# Altium schematic sheet -LTC3417.SchDoc
size A4
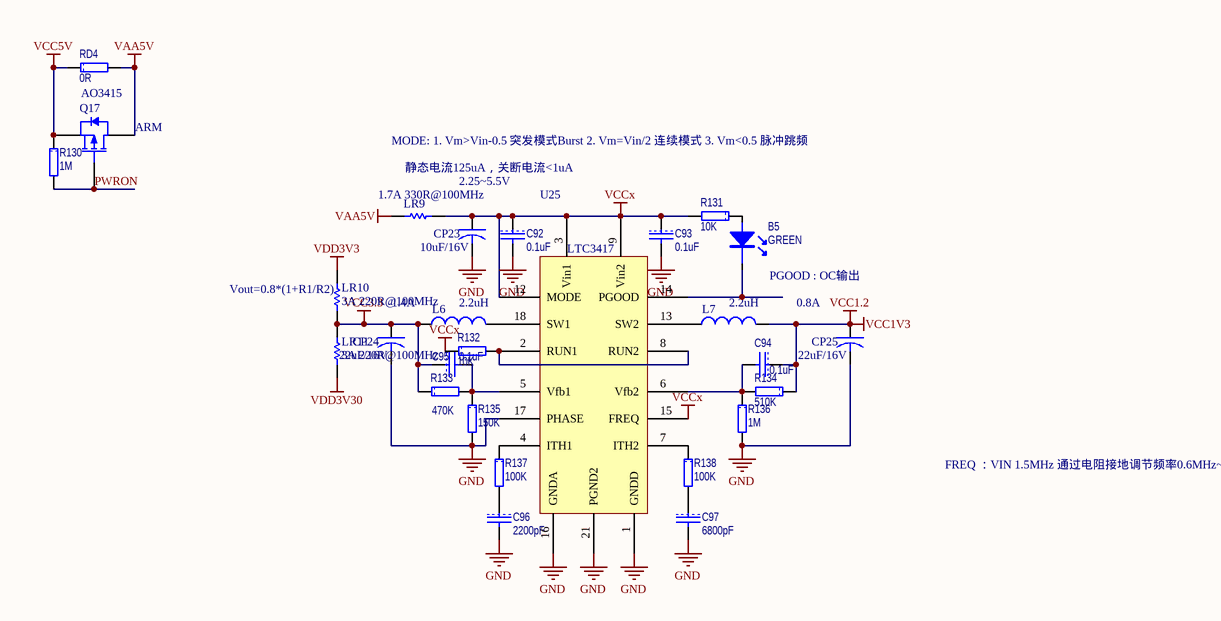
[diagram p0: -LTC3417.SchDoc]

## Parts
B5  GREEN  [LED0805]
C92  0.1uF  [1608[0603]]
C93  0.1uF  [1608[0603]]
C94  0.1uF  [1608[0603]]
C95  0.1uF  [1608[0603]]
C96  2200pF  [1608[0603]]
C97  6800pF  [1608[0603]]
CP23  10uF/16V  [3216[1206]]
CP24  22uF/16V  [3216[1206]]
CP25  22uF/16V  [3216[1206]]
L6  value 2.2uH  [INDP5050X28N - duplicate]  (hidden comment: CDRH4D22/HP 1R5)
L7  value 2.2uH  [INDP3232]  (hidden comment: CDRH2D18/HP 2R2)
LR9  value 1.7A 330R@100MHz  [0603RV]  (hidden comment: MPZ1608S331A)
LR10  value 3A 220R@100MHz  [2012[0805]]  (hidden comment: MPZ2012S221A)
LR11  value 3A 220R@100MHz  [2012[0805]]  (hidden comment: MPZ2012S221A)
Q17  AO3415  [SOT23_N]
R130  1M  [0603R]
R131  10K  [0603R]
R132  10K  [0603R]
R133  470K  [0603R]
R134  510K  [0603R]
R135  150K  [0603R]
R136  1M  [0603R]
R137  100K  [0603R]
R138  100K  [0603R]
RD4  0R  [0603RN]
U25  LTC3417  [TSSOP20-FE/CA]

## Nets
GND: C92.2 C93.2 C96.2 C97.2 CP23.2 CP24.2 CP25.2 R135.2 R136.2 U25.1(GNDD) U25.16(GNDA) U25.17(PHASE) U25.21(PGND2)
VAA5V: LR9.1 Q17.3(D) RD4.2
VCC1.2: C94.1 CP25.1 L7.2 R134.1  [also labelled VCC1V3]
VCC3.3: C95.1 CP24.1 L6.1 LR10.1 LR11.2 R133.1
VCC5V: Q17.2(S) R130.1 RD4.1
VCCx: C92.1 C93.1 CP23.1 LR9.2 R131.2 R132.1 U25.3(Vin1) U25.9(Vin2) U25.12(MODE) U25.15(FREQ)
VDD3V3: LR10.2
VDD3V30: LR11.1
PWRON: Q17.1(G) R130.2
NetB5_1: B5.1 R131.1
NetB5_2: B5.2 U25.14(PGOOD)
NetC94_2: C94.2 R134.2 R136.1 U25.6(Vfb2)
NetC95_2: C95.2 R133.2 R135.1 U25.5(Vfb1)
NetC96_1: C96.1 R137.2
NetC97_1: C97.1 R138.2
NetL6_2: L6.2 U25.18(SW1)
NetL7_1: L7.1 U25.13(SW2)
NetR132_2: R132.2 U25.2(RUN1) U25.8(RUN2)
NetR137_1: R137.1 U25.4(ITH1)
NetR138_1: R138.1 U25.7(ITH2)

Not connected (* = marked no-connect by the designer): U25 10(PGND2) 11(PGND2) 19(PGND1) 20(GNDD)

## Notes on the sheet
- (near Q17) ARM
- MODE: 1. Vm>Vin-0.5 突发模式Burst 2. Vm=Vin/2 连续模式 3. Vm<0.5 脉冲跳频
- 静态电流125uA，关断电流<1uA
- 2.25~5.5V
- (near LR10) Vout=0.8*(1+R1/R2)
- 1.4A
- PGOOD : OC输出
- 0.8A
- FREQ ：VIN 1.5MHz 通过电阻接地调节频率0.6MHz~4MHz

## Library data of the parts
B5 = LED: 发光管
C92-C95 = CAP: Capacitor; Manufacturer: TDK; Value: C0603X7R1H104K; Type: 无铅电容; Model: TDK C0603X7R1H104K
C96 C97 = CAP: Capacitor; Manufacturer: TDK; Value: C0603X7R1H225K; Type: 无铅电容
CP23-CP25 = CAPACITOR: Tantalum Capacitor; Compy: TAJ; name: TAJ-A-106-M-010-R
L6 L7 = Inductor: Code_IEC: 1005; parameters: 3.5A; 公司: SUMIDA; Published: 8-Jun-2000; LatestRevisionDate: 29-May-2009; LatestRevisionNote: IPC-7351 Footprint Added.; PackageReference: 0402-A; Publisher: Altium Limited; PackageDescription: Chip Inductor; Code_JEITA: 0402; Manufacturer: *
LR9-LR11 = Res Semi: Semiconductor Resistor; 公司: TDK; Published: 8-Jun-2000; LatestRevisionDate: 17-Jul-2002; LatestRevisionNote: Re-released for DXP Platform.; PackageReference: AXIAL-0.5; Publisher: Altium Limited; PackageDescription: Axial Device, Thru-Hole; 2 Leads; 0.5 in Pin Spacing
Q17 = BSH205: P-channel Enhancement Mode MOSFET; Published: 17-Sep-2003; LatestRevisionDate: 12-Dec-2006; LatestRevisionNote: IPC-7351 Footprint Added.; DatasheetVersion: Aug-1998; PackageVersion: May-1999; PackageReference: SOT23; Publisher: Altium Limited; PackageDescription: 3-Pin SOT-23 Package 0.95 mm Pitch, 2.3 mm Lead Span; ComponentLink1Description: Manufacturer Link; ComponentLink1URL: http://www.semiconductors.philips.com/; ComponentLink2Description: Datasheet; ComponentLink2URL: http://www.semiconductors.philips.com/acrobat/datasheets/BSH205_3.pdf
R130 = RES: Manufacturer: vishay; Model: CRCW06031M0KKEDTR; Value: 1M; Type: 无铅电阻
R131 = RES: Manufacturer: vishay; Model: CRCW060310K0KKEDTR; Value: 10K; Type: 无铅电阻
R132 = RES: Value: Vishay CRCW0603 10K0 KKEDTR; Type: 无铅电阻
R133 = RES: Value: Vishay CRCW0603 470K0 KKEDTR; Type: 无铅电阻
R134 = RES: Value: Vishay CRCW0603 510K0 KKEDTR; Type: 无铅电阻
R135 = RES: Value: Vishay CRCW0603 150K0 KKEDTR; Type: 无铅电阻
R136 = RES: Value: Vishay CRCW0603 1M0 KKEDTR; Type: 无铅电阻
R137 R138 = RES: Value: Vishay CRCW0603 100K0 KKEDTR; Type: 无铅电阻
RD4 = RES: Manufacturer: vishay; Model: RT0603DRD7D0RL; Value: 0R; Type: 无铅电阻
U25 = LTC3417: 电源管理